# Altium schematic sheet sika_UI.SchDoc: Sika UI
size A3; Author: Alberto Gianelli; Organization: MIND Music Labs; Address1: Jarlaplan 2; Address2: 11357 Stockholm, Sweden; Licence: cc-by-sa; Email: tech@elk.audio
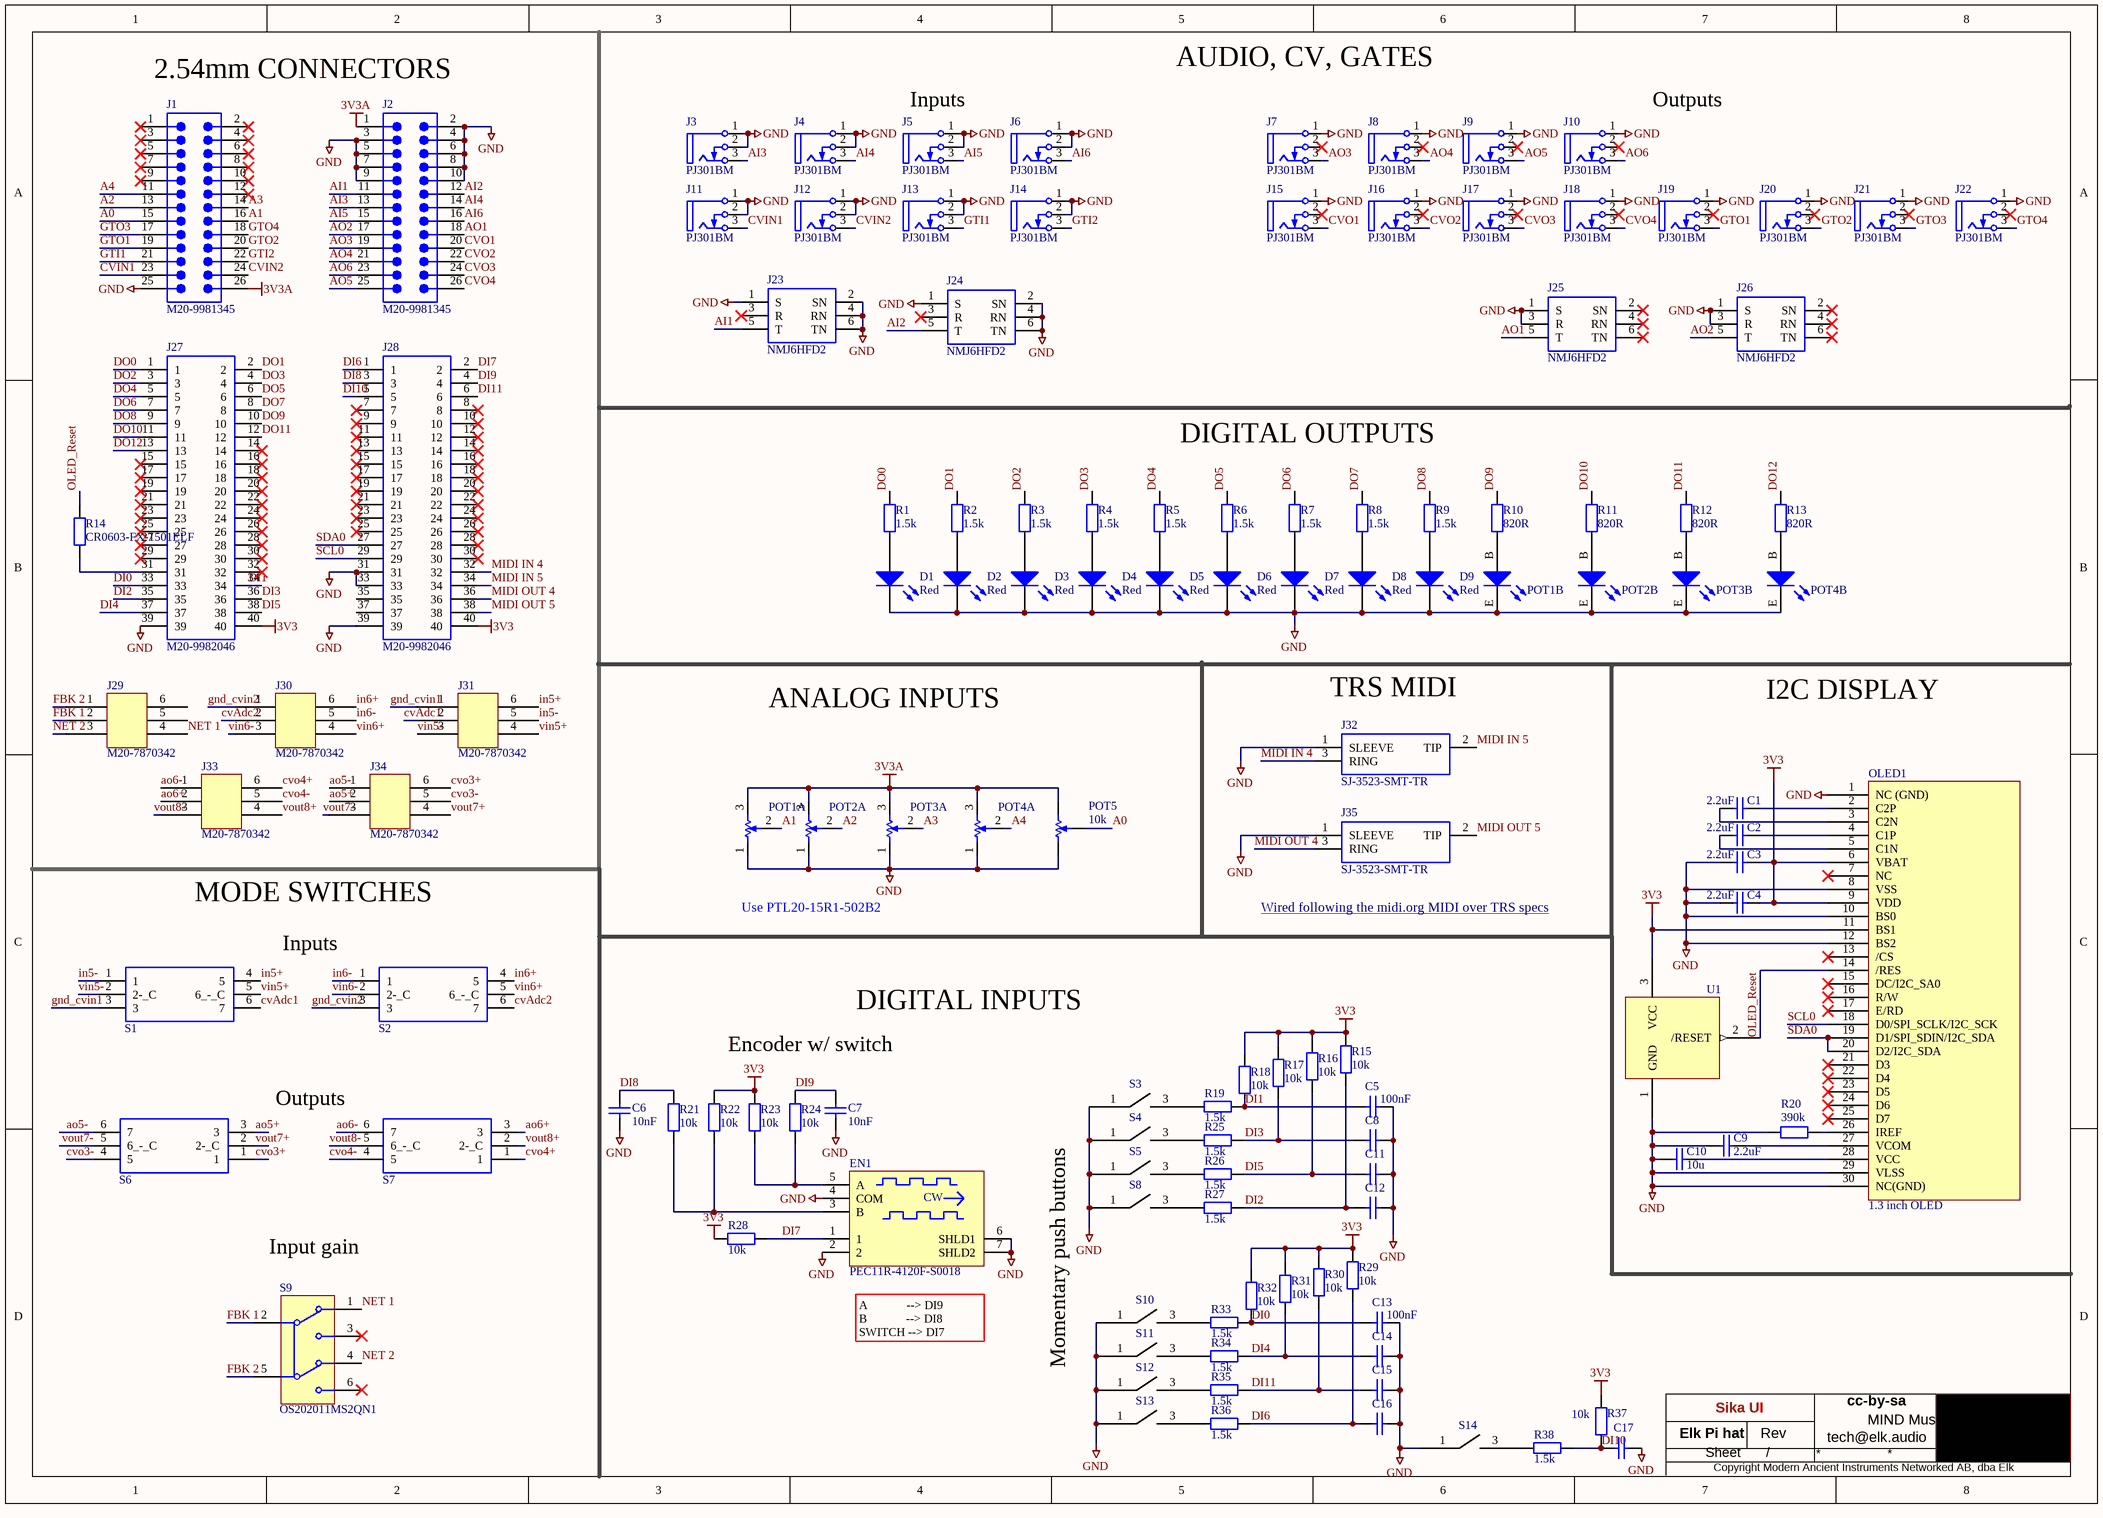
[diagram p0: sika_UI.SchDoc]

## Parts
C1  Capacitance: 2.2uF  [C0603]  (hidden comment: CL10B225KP8NNNC)
C2  Capacitance: 2.2uF  [C0603]  (hidden comment: CL10B225KP8NNNC)
C3  Capacitance: 2.2uF  [C0603]  (hidden comment: CL10B225KP8NNNC)
C4  Capacitance: 2.2uF  [C0603]  (hidden comment: CL10B225KP8NNNC)
C5  Capacitance: 100nF  [C0603]  (hidden comment: CL10B104KO8NNNC)
C6  Capacitance: 10nF  [C0603]  (hidden comment: CL10b103JB8NNNC)
C7  Capacitance: 10nF  [C0603]  (hidden comment: CL10b103JB8NNNC)
C8  CL10B104KO8NNNC  [C0603]  (value not drawn)
C9  Capacitance: 2.2uF  [C0603]  (hidden comment: CL10B225KP8NNNC)
C10  Capacitance: 10u  [C0603]  (hidden comment: CAP_10U)
C11  CL10B104KO8NNNC  [C0603]  (value not drawn)
C12  CL10B104KO8NNNC  [C0603]  (value not drawn)
C13  Capacitance: 100nF  [C0603]  (hidden comment: CL10B104KO8NNNC)
C14  CL10B104KO8NNNC  [C0603]  (value not drawn)
C15  CL10B104KO8NNNC  [C0603]  (value not drawn)
C16  CL10B104KO8NNNC  [C0603]  (value not drawn)
C17  CL10B104KO8NNNC  [C0603]  (value not drawn)
D1  Color: Red  [PCB-9pb35s7134wdnkutz46f-1]  (hidden comment: 0)
D2  Color: Red  [PCB-9pb35s7134wdnkutz46f-1]  (hidden comment: 0)
D3  Color: Red  [PCB-9pb35s7134wdnkutz46f-1]  (hidden comment: 0)
D4  Color: Red  [PCB-9pb35s7134wdnkutz46f-1]  (hidden comment: 0)
D5  Color: Red  [PCB-9pb35s7134wdnkutz46f-1]  (hidden comment: 0)
D6  Color: Red  [PCB-9pb35s7134wdnkutz46f-1]  (hidden comment: 0)
D7  Color: Red  [PCB-9pb35s7134wdnkutz46f-1]  (hidden comment: 0)
D8  Color: Red  [PCB-9pb35s7134wdnkutz46f-1]  (hidden comment: 0)
D9  Color: Red  [PCB-9pb35s7134wdnkutz46f-1]  (hidden comment: 0)
EN1  PEC11R-4120F-S0018  [BOUR-PEC11R-4XXXF-SXXXX_V - Cloned]
J1  M20-9981345  [HEADER_26]
J2  M20-9981345  [HEADER_26]
J3  PJ301BM  [PJ301BM]
J4  PJ301BM  [PJ301BM]
J5  PJ301BM  [PJ301BM]
J6  PJ301BM  [PJ301BM]
J7  PJ301BM  [PJ301BM]
J8  PJ301BM  [PJ301BM]
J9  PJ301BM  [PJ301BM]
J10  PJ301BM  [PJ301BM]
J11  PJ301BM  [PJ301BM]
J12  PJ301BM  [PJ301BM]
J13  PJ301BM  [PJ301BM]
J14  PJ301BM  [PJ301BM]
J15  PJ301BM  [PJ301BM]
J16  PJ301BM  [PJ301BM]
J17  PJ301BM  [PJ301BM]
J18  PJ301BM  [PJ301BM]
J19  PJ301BM  [PJ301BM]
J20  PJ301BM  [PJ301BM]
J21  PJ301BM  [PJ301BM]
J22  PJ301BM  [PJ301BM]
J23  NMJ6HFD2  [NMJ6HFD2]
J24  NMJ6HFD2  [NMJ6HFD2]
J25  NMJ6HFD2  [NMJ6HFD2]
J26  NMJ6HFD2  [NMJ6HFD2]
J27  M20-9982046  [header2x20]
J28  M20-9982046  [header2x20]
J29  M20-7870342  [M207870342]
J30  M20-7870342  [M207870342]
J31  M20-7870342  [M207870342]
J32  SJ-3523-SMT-TR  [SJ3523SMTTR]
J33  M20-7870342  [M207870342]
J34  M20-7870342  [M207870342]
J35  SJ-3523-SMT-TR  [SJ3523SMTTR]
OLED1  1.3 inch OLED  [1.3 inch OLED]
POT1  PTL20-15R1  [slide pot 20 mm]  (value not drawn)  (parts A,B of 2)
POT2  PTL20-15R1  [slide pot 20 mm]  (value not drawn)  (parts A,B of 2)
POT3  PTL20-15R1  [slide pot 20 mm]  (value not drawn)  (parts A,B of 2)
POT4  PTL20-15R1  [slide pot 20 mm]  (value not drawn)  (parts A,B of 2)
POT5  10k  [trim pot 25mm]
R1  Resistance: 1.5k  [R0603]  (hidden comment: CR0603-FX-1501ELF)
R2  Resistance: 1.5k  [R0603]  (hidden comment: CR0603-FX-1501ELF)
R3  Resistance: 1.5k  [R0603]  (hidden comment: CR0603-FX-1501ELF)
R4  Resistance: 1.5k  [R0603]  (hidden comment: CR0603-FX-1501ELF)
R5  Resistance: 1.5k  [R0603]  (hidden comment: CR0603-FX-1501ELF)
R6  Resistance: 1.5k  [R0603]  (hidden comment: CR0603-FX-1501ELF)
R7  Resistance: 1.5k  [R0603]  (hidden comment: CR0603-FX-1501ELF)
R8  Resistance: 1.5k  [R0603]  (hidden comment: CR0603-FX-1501ELF)
R9  Resistance: 1.5k  [R0603]  (hidden comment: CR0603-FX-1501ELF)
R10  Resistance: 820R  [R0603]  (hidden comment: CR0603-FX-1501ELF)
R11  Resistance: 820R  [R0603]  (hidden comment: CR0603-FX-1501ELF)
R12  Resistance: 820R  [R0603]  (hidden comment: CR0603-FX-1501ELF)
R13  Resistance: 820R  [R0603]  (hidden comment: CR0603-FX-1501ELF)
R14  CR0603-FX-1501ELF  [R0603]
R15  Resistance: 10k  [R0603]  (hidden comment: CR0603-FX-1002ELF)
R16  Resistance: 10k  [R0603]  (hidden comment: CR0603-FX-1002ELF)
R17  Resistance: 10k  [R0603]  (hidden comment: CR0603-FX-1002ELF)
R18  Resistance: 10k  [R0603]  (hidden comment: CR0603-FX-1002ELF)
R19  Resistance: 1.5k  [R0603]  (hidden comment: CR0603-FX-1501ELF)
R20  390k  [R0603]
R21  Resistance: 10k  [R0603]  (hidden comment: CR0603-FX-1002ELF)
R22  Resistance: 10k  [R0603]  (hidden comment: CR0603-FX-1002ELF)
R23  Resistance: 10k  [R0603]  (hidden comment: CR0603-FX-1002ELF)
R24  Resistance: 10k  [R0603]  (hidden comment: CR0603-FX-1002ELF)
R25  Resistance: 1.5k  [R0603]  (hidden comment: CR0603-FX-1501ELF)
R26  Resistance: 1.5k  [R0603]  (hidden comment: CR0603-FX-1501ELF)
R27  Resistance: 1.5k  [R0603]  (hidden comment: CR0603-FX-1501ELF)
R28  Resistance: 10k  [R0603]  (hidden comment: CR0603-FX-1002ELF)
R29  Resistance: 10k  [R0603]  (hidden comment: CR0603-FX-1002ELF)
R30  Resistance: 10k  [R0603]  (hidden comment: CR0603-FX-1002ELF)
R31  Resistance: 10k  [R0603]  (hidden comment: CR0603-FX-1002ELF)
R32  Resistance: 10k  [R0603]  (hidden comment: CR0603-FX-1002ELF)
R33  Resistance: 1.5k  [R0603]  (hidden comment: CR0603-FX-1501ELF)
R34  Resistance: 1.5k  [R0603]  (hidden comment: CR0603-FX-1501ELF)
R35  Resistance: 1.5k  [R0603]  (hidden comment: CR0603-FX-1501ELF)
R36  Resistance: 1.5k  [R0603]  (hidden comment: CR0603-FX-1501ELF)
R37  Resistance: 10k  [R0603]  (hidden comment: CR0603-FX-1002ELF)
R38  Resistance: 1.5k  [R0603]  (hidden comment: CR0603-FX-1501ELF)
S1  *JS202011JAQN  [JS202011JAQN]  (value not drawn)
S2  *JS202011JAQN  [JS202011JAQN]  (value not drawn)
S3  Red Tact  [tactile_switch]  (value not drawn)
S4  Red Tact  [tactile_switch]  (value not drawn)
S5  Red Tact  [tactile_switch]  (value not drawn)
S6  *JS202011JAQN  [JS202011JAQN]  (value not drawn)
S7  *JS202011JAQN  [JS202011JAQN]  (value not drawn)
S8  Red Tact  [tactile_switch]  (value not drawn)
S9  OS202011MS2QN1  [OS202011MS2QN1]
S10  Red Tact  [tactile_switch]  (value not drawn)
S11  Red Tact  [tactile_switch]  (value not drawn)
S12  Black Tact  [tactile_switch]  (value not drawn)
S13  Red Tact  [tactile_switch]  (value not drawn)
S14  1825910-7  [tactile_switch]  (value not drawn)
U1  reset uC  [SOT95P245X110-3N]  (value not drawn)

## Nets
3V3: C3.1 C4.1 J27.40 J28.40 OLED1.6(VBAT) OLED1.9(VDD) OLED1.11(BS1) R15.2 R16.2 R17.2 R18.2 R22.2 R23.1 R28.2 R29.2 R30.2 R31.2 R32.2 R37.2 U1.3(VCC)
3V3A: J1.26 J2.1 POT1.3 POT2.3 POT3.3 POT4.3 POT5.P$1
GND: C3.2 C4.2 C5.2 C6.1 C7.1 C8.2 C9.2 C10.2 C11.2 C12.2 C13.2 C14.2 C15.2 C16.2 C17.2 D1.2(K) D2.2(K) D3.2(K) D4.2(K) D5.2(K) D6.2(K) D7.2(K) D8.2(K) D9.2(K) EN1.2 EN1.4(COM) EN1.6(SHLD1) EN1.7(SHLD2) J1.25 J2.2 J2.3 J2.4 J2.5 J2.6 J2.7 J2.8 J2.9 J2.10 J3.1(S) J3.2(TN) J4.1(S) J4.2(TN) J5.1(S) J5.2(TN) J6.1(S) J6.2(TN) J7.1(S) J8.1(S) J9.1(S) J10.1(S) J11.1(S) J11.2(TN) J12.1(S) J12.2(TN) J13.1(S) J13.2(TN) J14.1(S) J14.2(TN) J15.1(S) J16.1(S) J17.1(S) J18.1(S) J19.1(S) J20.1(S) J21.1(S) J22.1(S) J23.1(S) J23.2(SN) J23.4(RN) J23.6(TN) J24.1(S) J24.2(SN) J24.4(RN) J24.6(TN) J25.1(S) J25.3(R) J26.1(S) J26.3(R) J27.39 J28.31 J28.33 J28.39 J32.1(SLEEVE) J35.1(SLEEVE) OLED1.1(NC_(GND)) OLED1.8(VSS) OLED1.10(BS0) OLED1.12(BS2) OLED1.29(VLSS) OLED1.30(NC(GND)) POT1.1 POT1.E POT2.1 POT2.E POT3.1 POT3.E POT4.1 POT4.E POT5.P$3 R20.1 S3.1 S4.1 S5.1 S8.1 S10.1 S11.1 S12.1 S13.1 S14.1 U1.1(GND)
A0: J1.15 POT5.P$2
A1: J1.16 POT1.2
A2: J1.13 POT2.2
A3: J1.14 POT3.2
A4: J1.11 POT4.2
AI1: J2.11 J23.5(T)
AI2: J2.12 J24.5(T)
AI3: J2.13 J3.3(T)
AI4: J2.14 J4.3(T)
AI5: J2.15 J5.3(T)
AI6: J2.16 J6.3(T)
AO1: J2.18 J25.5(T)
AO2: J2.17 J26.5(T)
AO3: J2.19 J7.3(T)
AO4: J2.21 J8.3(T)
AO5: J2.25 J9.3(T)
ao5+: J34.2 S6.3
ao5-: J34.1 S6.6(7)
AO6: J2.23 J10.3(T)
ao6+: J33.2 S7.3
ao6-: J33.1 S7.6(7)
cvAdc1: J31.2 S1.6(7)
cvAdc2: J30.2 S2.6(7)
CVIN1: J1.23 J11.3(T)
CVIN2: J1.24 J12.3(T)
CVO1: J2.20 J15.3(T)
CVO2: J2.22 J16.3(T)
CVO3: J2.24 J17.3(T)
cvo3+: J34.6 S6.1
cvo3-: J34.5 S6.4(5)
CVO4: J2.26 J18.3(T)
cvo4+: J33.6 S7.1
cvo4-: J33.5 S7.4(5)
DI0: C13.1 J27.33 R32.1 R33.1
DI1: C5.1 J27.34 R18.1 R19.1
DI2: C12.1 J27.35 R15.1 R27.1
DI3: C8.1 J27.36 R17.1 R25.1
DI4: C14.1 J27.37 R31.1 R34.1
DI5: C11.1 J27.38 R16.1 R26.1
DI6: C16.1 J28.1 R29.1 R36.1
DI7: EN1.1 J28.2 R28.1
DI8: C6.2 J28.3 R21.1
DI9: C7.2 J28.4 R24.2
DI10: C17.1 J28.5 R37.1 R38.1
DI11: C15.1 J28.6 R30.1 R35.1
DO0: J27.1 R1.2
DO1: J27.2 R2.2
DO2: J27.3 R3.2
DO3: J27.4 R4.2
DO4: J27.5 R5.2
DO5: J27.6 R6.2
DO6: J27.7 R7.2
DO7: J27.8 R8.2
DO8: J27.9 R9.2
DO9: J27.10 R10.2
DO10: J27.11 R11.2
DO11: J27.12 R12.2
DO12: J27.13 R13.2
FBK 1: J29.2 S9.2
FBK 2: J29.1 S9.5
gnd_cvin1: J31.1 S1.3
gnd_cvin2: J30.1 S2.3
GTI1: J1.21 J13.3(T)
GTI2: J1.22 J14.3(T)
GTO1: J1.19 J19.3(T)
GTO2: J1.20 J20.3(T)
GTO3: J1.17 J21.3(T)
GTO4: J1.18 J22.3(T)
in5+: J31.6 S1.4(5)
in5-: J31.5 S1.1
in6+: J30.6 S2.4(5)
in6-: J30.5 S2.1
MIDI IN 4: J28.32 J32.3(RING)
MIDI IN 5: J28.34 J32.2(TIP)
MIDI OUT 4: J28.36 J35.3(RING)
MIDI OUT 5: J28.38 J35.2(TIP)
NET 1: J29.4 S9.1
NET 2: J29.3 S9.4
OLED_Reset: OLED1.14(/RES) R14.2 U1.2(/RESET)
SCL0: J28.29 OLED1.18(D0/SPI_SCLK/I2C_SCK)
SDA0: J28.27 OLED1.19(D1/SPI_SDIN/I2C_SDA) OLED1.20(D2/I2C_SDA)
vin5+: J31.4 S1.5(6_-_C)
vin5-: J31.3 S1.2(2-_C)
vin6+: J30.4 S2.5(6_-_C)
vin6-: J30.3 S2.2(2-_C)
vout7+: J34.4 S6.2(2-_C)
vout7-: J34.3 S6.5(6_-_C)
vout8+: J33.4 S7.2(2-_C)
vout8-: J33.3 S7.5(6_-_C)
NetC1_1: C1.1 OLED1.2(C2P)
NetC1_2: C1.2 OLED1.3(C2N)
NetC2_1: C2.1 OLED1.4(C1P)
NetC2_2: C2.2 OLED1.5(C1N)
NetC9_1: C9.1 OLED1.27(VCOM)
NetC10_1: C10.1 OLED1.28(VCC)
NetD1_1: D1.1(A) R1.1
NetD2_1: D2.1(A) R2.1
NetD3_1: D3.1(A) R3.1
NetD4_1: D4.1(A) R4.1
NetD5_1: D5.1(A) R5.1
NetD6_1: D6.1(A) R6.1
NetD7_1: D7.1(A) R7.1
NetD8_1: D8.1(A) R8.1
NetD9_1: D9.1(A) R9.1
NetEN1_3: EN1.3(B) R21.2 R22.1
NetEN1_5: EN1.5(A) R23.2 R24.1
NetJ27_31: J27.31 R14.1
NetOLED1_26: OLED1.26(IREF) R20.2
NetPOT1_B: POT1.B R10.1
NetPOT2_B: POT2.B R11.1
NetPOT3_B: POT3.B R12.1
NetPOT4_B: POT4.B R13.1
NetR19_2: R19.2 S3.3
NetR25_2: R25.2 S4.3
NetR26_2: R26.2 S5.3
NetR27_2: R27.2 S8.3
NetR33_2: R33.2 S10.3
NetR34_2: R34.2 S11.3
NetR35_2: R35.2 S12.3
NetR36_2: R36.2 S13.3
NetR38_2: R38.2 S14.3

Not connected (* = marked no-connect by the designer): J1 1* 2* 3* 4* 5* 6* 7* 8* 9* 10* 12*; J7 2(TN)*; J8 2(TN)*; J9 2(TN)*; J10 2(TN)*; J15 2(TN)*; J16 2(TN)*; J17 2(TN)*; J18 2(TN)*; J19 2(TN)*; J20 2(TN)*; J21 2(TN)*; J22 2(TN)*; J23 3(R)*; J24 3(R)*; J25 2(SN)* 4(RN)* 6(TN)*; J26 2(SN)* 4(RN)* 6(TN)*; J27 14* 15* 16* 17* 18* 19* 20* 21* 22* 23* 24* 25* 26* 27* 28* 29* 30* 32*; J28 7* 8* 9* 10* 11* 12* 13* 14* 15* 16* 17* 18* 19* 20* 21* 22* 23* 24* 25* 26* 28* 30* 35 37; J29 5 6; OLED1 7(NC)* 13(/CS)* 15(DC/I2C_SA0)* 16(R/W)* 17(E/RD)* 21(D3)* 22(D4)* 23(D5)* 24(D6)* 25(D7)*; S3 2 4; S4 2 4; S5 2 4; S8 2 4; S9 3* 6*; S10 2 4; S11 2 4; S12 2 4; S13 2 4; S14 2 4

## Notes on the sheet
- 2.54mm CONNECTORS
- (near J5) Inputs
- AUDIO, CV, GATES
- (near J10) Outputs
- DIGITAL OUTPUTS
- ANALOG INPUTS
- (near J32) TRS MIDI
- I2C DISPLAY
- MODE SWITCHES
- Use PTL20-15R1-502B2
- (near J35) Wired following the midi.org MIDI over TRS specs <https://www.midi.org/articles-old/trs-specification-adopted-and-released>
- Inputs
- Encoder w/ switch
- DIGITAL INPUTS
- Outputs
- (near S9) Input gain
- (near EN1) A             --> DI9
  B             --> DI8
  SWITCH --> DI7
- Momentary push buttons
- Elk Pi hat
- Sheet
- Rev
- /
- Copyright Modern Ancient Instruments Networked AB, dba Elk
- (in symbol PEC11R-4120F-S0018) CW

## Library data of the parts
C1-C4 C9 = CAP_2U2: Cap Ceramic 10%; Manufacturer: Samsung; Dielectric: X7R; Voltage Rating: 10V; Mount: Surface Mount; Case/Package: 0603; Material: Ceramic; Tolerance: 10%; Length: 1.6mm; ComponentLink1URL: https://www.verical.com/server-webapp/html/getDatasheet?partID=357418&src-supplier=Verical; ComponentLink1Description: https://www.verical.com/server-webapp/html/getDatasheet?partID=357418&src-supplier=Verical; ComponentLink2URL: https://produktinfo.conrad.com/datenblaetter/450000-474999/458176-da-01-en-VS_KONDENSATOR_0603.pdf?src-supplier=Conrad; ComponentLink2Description: https://produktinfo.conrad.com/datenblaetter/450000-474999/458176-da-01-en-VS_KONDENSATOR_0603.pdf?src-supplier=Conrad; Supplier 1: Digi-Key; Supplier 2: Digi-Key; Supplier Part Number 1: 1276-1134-1-ND; Supplier Part Number 2: 1276-1134-6-ND
C5 C13 = CAP_100N: Cap Ceramic 10%; Manufacturer: Samsung; Manufacturer Part Number: CL10B105KO8NNNC; Dielectric: X7R; Voltage Rating: 16V; RoHS: Yes; Mount: Surface Mount; Case/Package: 0603; Case Code (Metric): 1608; Case Code (Imperial): 0603; Material: Ceramic; Min Operating Temperature: -55°C; Max Operating Temperature: 125°C; Tolerance: 10%; Packaging: Tape and Reel; Voltage: 16V; Voltage Rating (DC): 16V; Length: 1.6mm; Height: 0.8mm; Width: 0.031inch; Thickness: 0.035inch; Depth: 0.8mm; Radiation Hardening: No; Lead Free: Lead Free; ComponentLink1URL: https://www.verical.com/server-webapp/html/getDatasheet?partID=357418&src-supplier=Verical; ComponentLink1Description: https://www.verical.com/server-webapp/html/getDatasheet?partID=357418&src-supplier=Verical; ComponentLink2URL: https://produktinfo.conrad.com/datenblaetter/450000-474999/458176-da-01-en-VS_KONDENSATOR_0603.pdf?src-supplier=Conrad; ComponentLink2Description: https://produktinfo.conrad.com/datenblaetter/450000-474999/458176-da-01-en-VS_KONDENSATOR_0603.pdf?src-supplier=Conrad; Supplier 1: Digi-Key; Supplier 2: Digi-Key; Supplier Part Number 1: 1276-1005-1-ND; Supplier Part Number 2: 1276-1005-2-ND
C6 C7 = CAP_10N: Cap Ceramic 10%; Manufacturer: Samsung; Manufacturer Part Number: CL10B105KO8NNNC; Voltage Rating: 16V; Dielectric: x7r; RoHS: Yes; Mount: Surface Mount; Case/Package: 0603; Case Code (Metric): 1608; Case Code (Imperial): 0603; Material: Ceramic; Min Operating Temperature: -55°C; Max Operating Temperature: 125°C; Tolerance: 10%; Packaging: Tape and Reel; Voltage: 16V; Voltage Rating (DC): 16V; Length: 1.6mm; Height: 0.8mm; Width: 0.031inch; Thickness: 0.035inch; Depth: 0.8mm; Radiation Hardening: No; Lead Free: Lead Free; ComponentLink1URL: https://www.verical.com/server-webapp/html/getDatasheet?partID=357418&src-supplier=Verical; ComponentLink1Description: https://www.verical.com/server-webapp/html/getDatasheet?partID=357418&src-supplier=Verical; ComponentLink2URL: https://produktinfo.conrad.com/datenblaetter/450000-474999/458176-da-01-en-VS_KONDENSATOR_0603.pdf?src-supplier=Conrad; ComponentLink2Description: https://produktinfo.conrad.com/datenblaetter/450000-474999/458176-da-01-en-VS_KONDENSATOR_0603.pdf?src-supplier=Conrad; Supplier 1: Digi-Key; Supplier Part Number 1: 1276-1103-1-ND
C8 C11 C12 C14-C17 = CAP_100N: Cap Ceramic 10%; Manufacturer: Samsung; Manufacturer Part Number: CL10B105KO8NNNC; Dielectric: X7R; Voltage Rating: 16V; Capacitance: 100nF; RoHS: Yes; Mount: Surface Mount; Case/Package: 0603; Case Code (Metric): 1608; Case Code (Imperial): 0603; Material: Ceramic; Min Operating Temperature: -55°C; Max Operating Temperature: 125°C; Tolerance: 10%; Packaging: Tape and Reel; Voltage: 16V; Voltage Rating (DC): 16V; Length: 1.6mm; Height: 0.8mm; Width: 0.031inch; Thickness: 0.035inch; Depth: 0.8mm; Radiation Hardening: No; Lead Free: Lead Free; ComponentLink1URL: https://www.verical.com/server-webapp/html/getDatasheet?partID=357418&src-supplier=Verical; ComponentLink1Description: https://www.verical.com/server-webapp/html/getDatasheet?partID=357418&src-supplier=Verical; ComponentLink2URL: https://produktinfo.conrad.com/datenblaetter/450000-474999/458176-da-01-en-VS_KONDENSATOR_0603.pdf?src-supplier=Conrad; ComponentLink2Description: https://produktinfo.conrad.com/datenblaetter/450000-474999/458176-da-01-en-VS_KONDENSATOR_0603.pdf?src-supplier=Conrad; Supplier 1: Digi-Key; Supplier 2: Digi-Key; Supplier Part Number 1: 1276-1005-1-ND; Supplier Part Number 2: 1276-1005-2-ND
C10 = CAP_10U: Cap Ceramic 10%; Manufacturer: Samsung; Manufacturer Part Number: CL10B105KO8NNNC; Dielectric: X7R; Voltage Rating: 16V; Mount: Surface Mount; Case/Package: 0603; Material: Ceramic; Tolerance: 10%; Length: 1.6mm; ComponentLink1URL: https://www.verical.com/server-webapp/html/getDatasheet?partID=357418&src-supplier=Verical; ComponentLink1Description: https://www.verical.com/server-webapp/html/getDatasheet?partID=357418&src-supplier=Verical; ComponentLink2URL: https://produktinfo.conrad.com/datenblaetter/450000-474999/458176-da-01-en-VS_KONDENSATOR_0603.pdf?src-supplier=Conrad; ComponentLink2Description: https://produktinfo.conrad.com/datenblaetter/450000-474999/458176-da-01-en-VS_KONDENSATOR_0603.pdf?src-supplier=Conrad; Supplier 1: Digi-Key; Supplier 2: Digi-Key; Supplier Part Number 1: 1276-1005-1-ND; Supplier Part Number 2: 1276-1005-2-ND; RoHS: Yes; Case Code (Metric): 1608; Case Code (Imperial): 0603; Min Operating Temperature: -55°C; Max Operating Temperature: 125°C; Packaging: Tape and Reel; Voltage: 16V; Voltage Rating (DC): 16V; Height: 0.8mm; Width: 0.031inch; Thickness: 0.035inch; Depth: 0.8mm; Radiation Hardening: No; Lead Free: Lead Free
D1-D9 = CMP-3990f44d6d24e657-1: Standard LEDs; SMD 0610 Dome Lens LED; 1.6x0.8 mm; Red; (Cut Reel); Manufacturer Part Number: APTD1608LSURCK; Octopart URL: http://octopart.com/aptd1608lsurck-kingbright-81228242; OctopartID: 3990f44d6d24e657; Supplier 1: Digi-Key; Supplier Part Number 1: 754-2038-1-ND
EN1 = PEC11R-4120F-S0018: Encoders 20mm SHAFT w/SWITCH; Manufacturer: Bourns; Number of Channels: 2; Encoder Type: Mechanical; Pulses per Revolution: 18; Detent: Yes; Output Type: Quadrature; Hole Diameter: 1mm; Supplier 1: Digi-Key; Manufacturer Part Number: PEC11R-4120F-S0018; Stock 1: 443; Pricing 1: 1 = 1,91000, 10 = 1,68200, 25 = 1,50800, 75 = 1,45000, 150 = 1,39200, 300 = 1,33400, 525 = 1,10200, 1050 = 1,04400, 5025 = 0,87000 (USD); RoHS: Yes; Mount: Through Hole; Number of Pins: 5; Min Operating Temperature: -30°C; Max Operating Temperature: 70°C; Package Quantity: 75; Packaging: Bulk; Termination: PC Pin; Orientation: Vertical; Built in Switch: Yes; Length: 26.5mm; Height: 13.4mm; Width: 12.5mm; Radiation Hardening: No; REACH SVHC: No SVHC; ComponentLink1URL: https://datasheet.ciiva.com/29519/pec11r-29519849.pdf?src-supplier=Digi-Key; ComponentLink1Description: https://datasheet.ciiva.com/29519/pec11r-29519849.pdf?src-supplier=Digi-Key; ComponentLink2URL: https://datasheet.ciiva.com/12176/pec11r-221203-12176941.pdf?src-supplier=Mouser; ComponentLink2Description: https://datasheet.ciiva.com/12176/pec11r-221203-12176941.pdf?src-supplier=Mouser; ComponentLink3URL: https://datasheet.ciiva.com/29927/pec11r-29927631.pdf?src-supplier=Avnet; ComponentLink3Description: https://datasheet.ciiva.com/29927/pec11r-29927631.pdf?src-supplier=Avnet; Supplier 2: Mouser; Stock 2: 160; Pricing 2: 1 = 1,91000, 10 = 1,50000, 50 = 1,45000, 100 = 1,39000, 1000 = 1,04000, 10000 = 0,87000 (USD); Supplier Part Number 1: PEC11R-4120F-S0018-ND; Supplier Part Number 2: 652-PEC11R-4120F-S18
J1 J2 = HEADER_26: CONN HEADER 26POS .100 STR 15AU; Manufacturer: Amphenol FCI; Manufacturer Part Number: 67997-226HLF; Number of Contacts: 26; Current Rating: 3A; Voltage Rating: 1.5kV; Insulation Resistance: 5GR; Gender: Male; Connector Type: Male Pin; Pitch: 2.54mm; Row Spacing: 0.1inch; Contact Post Length: 3.05mm; Contact Resistance: 25mR; RoHS: Yes; Mount: Through Hole; Contact Plating: Gold; Contact Material: Bronze; Color: Black; Housing Color: Black; Housing Material: Thermoplastic; Min Operating Temperature: -65°C; Max Operating Temperature: 125°C; Number of Rows: 2; Termination: Solder; Package Quantity: 100; Packaging: Bulk; Contact Gender: Male; Number of Positions: 26; Max Voltage Rating (AC): 1.5kV; Orientation: Straight; Length: 33.02mm; Contact Mating Length: 0.23inch; Depth: 4.83mm; Flammability Rating: UL94 V-0; ComponentLink1URL: https://datasheet.ciiva.com/5151/67996-223434-5151673.pdf?src-supplier=Mouser; ComponentLink1Description: https://datasheet.ciiva.com/5151/67996-223434-5151673.pdf?src-supplier=Mouser; ComponentLink2URL: https://datasheet.ciiva.com/729/67996-729016.pdf?src-supplier=Digi-Key; ComponentLink2Description: https://datasheet.ciiva.com/729/67996-729016.pdf?src-supplier=Digi-Key; ComponentLink3URL: https://datasheet.ciiva.com/16726/67996-16726297.pdf?src-supplier=Avnet+Europe; ComponentLink3Description: https://datasheet.ciiva.com/16726/67996-16726297.pdf?src-supplier=Avnet+Europe; ComponentLink4URL: https://datasheet.ciiva.com/10125/67996-10125053.pdf?src-supplier=Avnet; ComponentLink4Description: https://datasheet.ciiva.com/10125/67996-10125053.pdf?src-supplier=Avnet; ComponentLink5URL: http://www.mouser.com/ds/2/181/Harwin_Product_Catalog_page_207-1131241.pdf?src-supplier=Mouser; ComponentLink5Description: http://www.mouser.com/ds/2/181/Harwin_Product_Catalog_page_207-1131241.pdf?src-supplier=Mouser; Max Current Rating: 3A; ComponentLink6URL: http://components.arrow.com/part/dataview/0323_00725754?src-supplier=Arrow+Europe; ComponentLink6Description: http://components.arrow.com/part/dataview/0323_00725754?src-supplier=Arrow+Europe; ComponentLink7URL: http://www.harwin.com/include/downloads/pdfs/2010PAGE129.PDF?src-supplier=Avnet; ComponentLink7Description: http://www.harwin.com/include/downloads/pdfs/2010PAGE129.PDF?src-supplier=Avnet; ComponentLink8URL: https://cdn.harwin.com/pdfs/60page147.pdf?src-supplier=Avnet+Europe; ComponentLink8Description: https://cdn.harwin.com/pdfs/60page147.pdf?src-supplier=Avnet+Europe; Supplier 1: Digi-Key; Stock 1: 2058; Pricing 1: 1 = 0,91000, 10 = 0,80100, 100 = 0,69080, 500 = 0,56520, 1000 = 0,50240, 5000 = 0,43960, 10000 = 0,41762 (USD); ComponentLink9URL: http://cdn.harwin.com/pdfs/60page147.pdf?src-supplier=Digi-Key; ComponentLink9Description: http://cdn.harwin.com/pdfs/60page147.pdf?src-supplier=Digi-Key; ComponentLink10URL: https://cdn.harwin.com/pdfs/Harwin_PC_Connectors_M20.pdf?src-supplier=Digi-Key; ComponentLink10Description: https://cdn.harwin.com/pdfs/Harwin_PC_Connectors_M20.pdf?src-supplier=Digi-Key; Supplier Part Number 1: 952-3297-ND
J23-J26 = NMJ6HFD2: Phone Connectors 3C STEREO 3-SPST NC; Manufacturer_Name: Neutrik; Allied_Number: 70229136; Geometry.Height: 15.69mm; Manufacturer_Part_Number: NMJ6HFD2; Mouser Part Number: 550-20301; Mouser Price/Stock: https://www.mouser.com/Search/Refine.aspx?Keyword=550-20301; RS Part Number: *; RS Price/Stock: *; Allied Price/Stock: https://www.alliedelec.com/neutrik-nmj6hfd2/70229136/; Datasheet Link: https://www.neutrik.com/media/8586/download/st-nmj6hfd2.pdf?v=1
J27 J28 = HEADER_2X20: Unshrouded, Pitch 2.54 mm, 6.1 mm Mating distance; Manufacturer_Name: 3M; Manufacturer_Part_Number: 4P01-2A02-DA; Manufacturer: Harwin; Allied_Number: 70114575; Geometry.Height: 11.2mm; Number of Contacts: 20; Contact Resistance: 25mR; Max Current Rating: 3A; Gender: Male; Number of Positions: 40; Connector Type: Male Pin; Pitch: 0.1inch; RS Part Number: 8277403; RS Price/Stock: http://uk.rs-online.com/web/p/products/8277403; Allied Price/Stock: https://www.alliedelec.com/3m-4p01-2a02-da/70114575/; Arrow Part Number: 4P01-2A02-DA; Arrow Price/Stock: https://www.arrow.com/en/products/4p01-2a02-da/3m; Datasheet Link: http://multimedia.3m.com/mws/media/729589O/3mtm-conn-for-pc104-embedded-sys-apps-compliantbuscomp-cd2392.pdf; Supplier 1: Digi-Key; Manufacturer Part Number: M20-9982046; Stock 1: 281; Pricing 1: 1 = 1,40000, 10 = 1,22900, 100 = 1,06040, 500 = 0,86760, 1000 = 0,77120, 5000 = 0,67480, 10000 = 0,64106 (USD); RoHS: Yes; Mount: Through Hole; Contact Plating: Tin; Contact Material: Brass; Color: Black; Housing Color: Black; Housing Material: Nylon; Min Operating Temperature: -40°C; Max Operating Temperature: 105°C; Number of Rows: 2; Termination: Solder; Packaging: Bulk; Package Quantity: 100; Orientation: Straight; Length: 50.8mm; Row Spacing: 0.1inch; Depth: 5.08mm; Radiation Hardening: No; ComponentLink1URL: http://www.mouser.com/ds/2/181/Harwin_Product_Catalog_page_207-1131241.pdf?src-supplier=Mouser; ComponentLink1Description: http://www.mouser.com/ds/2/181/Harwin_Product_Catalog_page_207-1131241.pdf?src-supplier=Mouser; ComponentLink2URL: http://cdn.harwin.com/pdfs/60page147.pdf?src-supplier=Digi-Key; ComponentLink2Description: http://cdn.harwin.com/pdfs/60page147.pdf?src-supplier=Digi-Key; ComponentLink3URL: https://cdn.harwin.com/pdfs/M20-998.pdf?src-supplier=Digi-Key; ComponentLink3Description: https://cdn.harwin.com/pdfs/M20-998.pdf?src-supplier=Digi-Key; ComponentLink4URL: http://components.arrow.com/part/dataview/0323_00724856?src-supplier=Arrow+Europe; ComponentLink4Description: http://components.arrow.com/part/dataview/0323_00724856?src-supplier=Arrow+Europe; ComponentLink5URL: https://cdn.harwin.com/pdfs/Harwin_PC_Connectors_M20.pdf?src-supplier=Digi-Key; ComponentLink5Description: https://cdn.harwin.com/pdfs/Harwin_PC_Connectors_M20.pdf?src-supplier=Digi-Key; Supplier Part Number 1: 952-3298-ND; Weight: 0.083952oz; Contact Mating Length: 0.24inch; ComponentLink6URL: https://cdn.harwin.com/pdfs/60page147.pdf?src-supplier=Avnet+Europe; ComponentLink6Description: https://cdn.harwin.com/pdfs/60page147.pdf?src-supplier=Avnet+Europe
J29-J31 J33 J34 = M20-7870342: Manufacturer: Harwin; Number of Positions: 6; Connector Type: Receptacle,Socket; Pitch: 0.1inch; Supplier 1: Mouser; Manufacturer Part Number: M20-7870342; Stock 1: 5980; Pricing 1: 1 = 0,78000, 10 = 0,62600, 100 = 0,54400, 500 = 0,49000, 1000 = 0,43500, 2500 = 0,39400, 5000 = 0,38100, 10000 = 0,36200, 25000 = 0,34800 (USD); RoHS: Yes; Mount: Surface Mount; Color: Black; Contact Plating: Gold; Number of Rows: 2; Package Quantity: 73; Packaging: Rail/Tube; Termination: Solder; Row Spacing: 0.1inch; ComponentLink1URL: https://datasheet.ciiva.com/15015/m20-787-15015039.pdf?src-supplier=Digi-Key; ComponentLink1Description: https://datasheet.ciiva.com/15015/m20-787-15015039.pdf?src-supplier=Digi-Key; Supplier Part Number 1: 855-M20-7870342
J32 J35 = SJ-3523-SMT-TR: CONN JACK STEREO 3.5MM SMD R/A; Manufacturer: CUI; Gender: Female; Shielding: Unshielded; Current Rating: 1A; Number of Conductors: 3; Number of Ports: 1; Supplier 1: Digi-Key; Manufacturer Part Number: SJ-3523-SMT-TR; Stock 1: 33904; Pricing 1: 1 = 1,02000, 10 = 0,90000, 25 = 0,84760, 50 = 0,81220, 100 = 0,77680, 250 = 0,70620, 500 = 0,63558 (USD); RoHS: Yes; Mount: Surface Mount; Contact Plating: Silver; Color: Black; Packaging: Cut Tape; Termination: Solder; Connector Type: Jack; Orientation: Horizontal; Lead Free: Lead Free; ComponentLink1URL: https://datasheet.ciiva.com/7356/sj-352x-smt-series-7356569.pdf?src-supplier=Digi-Key; ComponentLink1Description: https://datasheet.ciiva.com/7356/sj-352x-smt-series-7356569.pdf?src-supplier=Digi-Key; ComponentLink2URL: https://datasheet.ciiva.com/7356/sj-352x-smt-series-7356553.pdf?src-supplier=Digi-Key; ComponentLink2Description: https://datasheet.ciiva.com/7356/sj-352x-smt-series-7356553.pdf?src-supplier=Digi-Key; Supplier Part Number 1: CP-3523SJCT-ND
POT5 = trimmer_pot: 25 mm tall (thonk); resistance: 10k; ComponentLink1Description: https://www.thonk.co.uk/shop/alpha-9mm-pots/; ComponentLink1URL: https://www.thonk.co.uk/shop/alpha-9mm-pots/
R1-R13 R19 R25-R27 R33-R36 R38 = RES_1K5: Resistor, Ceramic; Power rating: *mW; Precision: *%; Temp coefficient: *ppm; Voltage rating: *V; CustomComponentID: rbfzudi508nk54panp5s; Supplier 1: Digi-Key; Supplier Part Number 1: CR0603-FX-1501ELFCT-ND
R14 = RES_DNP: Resistor, Ceramic; Resistance: DNP; Power rating: *mW; Precision: *%; Temp coefficient: *ppm; Voltage rating: *V; CustomComponentID: rbfzudi508nk54panp5s; Supplier 1: Digi-Key; Supplier Part Number 1: CR0603-FX-1501ELFCT-ND
R15-R18 R21-R24 R28-R32 R37 = RES_10K: Resistor, Ceramic; Power rating: *mW; Precision: *%; Temp coefficient: *ppm; Voltage rating: *V; CustomComponentID: rbfzudi508nk54panp5s; Supplier 1: Digi-Key; Supplier Part Number 1: CR0603-FX-1002ELFCT-ND
R20 = RES_390K: Resistor, Ceramic; Power rating: *mW; Precision: *%; Temp coefficient: *ppm; Voltage rating: *V; CustomComponentID: rbfzudi508nk54panp5s; Resistance: 390k
S1 S2 S6 S7 = JS202011JAQN: SWITCH SMD SLIDE DPDT 300MA 6V; Manufacturer: ITT C&K; Supplier 1: Digi-Key; Manufacturer Part Number: JS202011JAQN; Stock 1: 8914; Pricing 1: 1 = 0,51000, 10 = 0,48800, 25 = 0,47760, 50 = 0,42680, 100 = 0,40660, 250 = 0,39640, 500 = 0,33542 (USD); RoHS: No; ComponentLink1URL: https://www.ckswitches.com/media/1422/js.pdf?src-supplier=Digi-Key; ComponentLink1Description: https://www.ckswitches.com/media/1422/js.pdf?src-supplier=Digi-Key; Supplier Part Number 1: CKN10722CT-ND
S3-S5 S8 S10-S13 = tactile_switch_red: Switch Tactile OFF (ON) SPST Round Button PC Pins 0.05A 24VDC 100000Cycles 2.55N Thru-Hole Loose; Manufacturer: TE Connectivity; Manufacturer Part Number: 1825910-7; Actuator Material: PBT; Max Voltage Rating (DC): 24V; Contact Resistance: 100mR; Illumination Type: Non-Illuminated; Contact Current Rating: 50mA; Switch Travel: 0.25mm; Switch Function: Off-Mom; Actuator Type: Standard; Actuator Length: 0.055inch; Supplier 1: Digi-Key; Stock 1: 162111; Pricing 1: 1 = 0,11000, 10 = 0,10600, 25 = 0,10240, 50 = 0,09900, 100 = 0,09340, 250 = 0,08792, 500 = 0,08428, 1000 = 0,06412, 5000 = 0,05313 (USD); RoHS: Yes; Mount: Through Hole; Contact Material: Copper Alloy; Contact Plating: Silver; Mechanical Life: 100000Cycles; Min Operating Temperature: -35°C; Max Operating Temperature: 85°C; Operating Force: 2.55N; Throw Configuration: SPST; Termination: PC Pins; Packaging: Loose Piece; Package Quantity: 750; Type: Switch; Voltage Rating (DC): 24V; Electrical Life: 100000Cycles; Orientation: Straight; Max Current Rating: 50mA; Length: 5.99mm; Depth: 7.8mm; Radiation Hardening: No; REACH SVHC: Unknown; ELV: Compliant; Lead Free: Lead Free; ComponentLink1URL: https://datasheet.ciiva.com/30117/17-30117153.pdf?src-supplier=Onlinecomponents.com; ComponentLink1Description: https://datasheet.ciiva.com/30117/17-30117153.pdf?src-supplier=Onlinecomponents.com; ComponentLink2URL: https://datasheet.ciiva.com/16312/1825910-7-16312610.pdf?src-supplier=Future+Electronics; ComponentLink2Description: https://datasheet.ciiva.com/16312/1825910-7-16312610.pdf?src-supplier=Future+Electronics; ComponentLink3URL: https://datasheet.ciiva.com/16987/0900766b808a3755-16987820.pdf?src-supplier=Allied+Electronics; ComponentLink3Description: https://datasheet.ciiva.com/16987/0900766b808a3755-16987820.pdf?src-supplier=Allied+Electronics; Supplier Part Number 1: 450-1804-ND
S9 = OS202011MS2QN1: SWITCH SLIDE DPDT 100MA 12V; Manufacturer: ITT C&K; Mechanical Life: 10000Cycles; Actuator Material: Polyoxymethylene,Acetal; Switch Travel: 2mm; Switch Function: On-On; Actuator Type: Standard; Actuator Length: 4mm; Supplier 1: Digi-Key; Manufacturer Part Number: OS202011MS2QN1; Stock 1: 4212; Pricing 1: 1 = 0,60000, 10 = 0,57200, 25 = 0,56000, 50 = 0,50060, 100 = 0,47670, 250 = 0,46480, 500 = 0,39328, 1000 = 0,38136, 5000 = 0,33369 (USD); RoHS: Yes; Mount: Through Hole,Brackets; Contact Material: Copper Alloy; Contact Plating: Silver,Gold; Housing Material: Resin; Min Operating Temperature: -30°C; Max Operating Temperature: 70°C; Throw Configuration: DPDT; Max Voltage Rating (DC): 12V; Packaging: Bulk; Termination: PC Pins; Orientation: Straight; Voltage Rating (DC): 12V; Max Current Rating: 100mA; Package Quantity: 200; Current Rating: 100mA; Electrical Life: 10000Cycles; Length: 8.6mm; Depth: 6.8mm; Radiation Hardening: No; REACH SVHC: No SVHC; Lead Free: Lead Free; ComponentLink1URL: https://datasheet.ciiva.com/2889/os-19jan15-2889195.pdf?src-supplier=Digi-Key; ComponentLink1Description: https://datasheet.ciiva.com/2889/os-19jan15-2889195.pdf?src-supplier=Digi-Key; Supplier Part Number 1: CKN9545-ND
S14 = tactile_switch_red: Switch Tactile OFF (ON) SPST Round Button PC Pins 0.05A 24VDC 100000Cycles 2.55N Thru-Hole Loose; Manufacturer: TE Connectivity; Actuator Material: PBT; Max Voltage Rating (DC): 24V; Contact Resistance: 100mR; Illumination Type: Non-Illuminated; Contact Current Rating: 50mA; Switch Travel: 0.25mm; Switch Function: Off-Mom; Actuator Type: Standard; Actuator Length: 0.055inch; Supplier 1: Digi-Key; Manufacturer Part Number: 1825910-7; Stock 1: 162111; Pricing 1: 1 = 0,11000, 10 = 0,10600, 25 = 0,10240, 50 = 0,09900, 100 = 0,09340, 250 = 0,08792, 500 = 0,08428, 1000 = 0,06412, 5000 = 0,05313 (USD); RoHS: Yes; Mount: Through Hole; Contact Material: Copper Alloy; Contact Plating: Silver; Mechanical Life: 100000Cycles; Min Operating Temperature: -35°C; Max Operating Temperature: 85°C; Operating Force: 2.55N; Throw Configuration: SPST; Termination: PC Pins; Packaging: Loose Piece; Package Quantity: 750; Type: Switch; Voltage Rating (DC): 24V; Electrical Life: 100000Cycles; Orientation: Straight; Max Current Rating: 50mA; Length: 5.99mm; Depth: 7.8mm; Radiation Hardening: No; REACH SVHC: Unknown; ELV: Compliant; Lead Free: Lead Free; ComponentLink1URL: https://datasheet.ciiva.com/30117/17-30117153.pdf?src-supplier=Onlinecomponents.com; ComponentLink1Description: https://datasheet.ciiva.com/30117/17-30117153.pdf?src-supplier=Onlinecomponents.com; ComponentLink2URL: https://datasheet.ciiva.com/16312/1825910-7-16312610.pdf?src-supplier=Future+Electronics; ComponentLink2Description: https://datasheet.ciiva.com/16312/1825910-7-16312610.pdf?src-supplier=Future+Electronics; ComponentLink3URL: https://datasheet.ciiva.com/16987/0900766b808a3755-16987820.pdf?src-supplier=Allied+Electronics; ComponentLink3Description: https://datasheet.ciiva.com/16987/0900766b808a3755-16987820.pdf?src-supplier=Allied+Electronics; Supplier Part Number 1: 450-1804-ND
U1 = APX803-xxSAG-7
OLED1 = 1.3 inch OLED: ComponentLink1Description: alibaba; ComponentLink1URL: https://www.alibaba.com/product-detail/OLED-1-3-Inch-SSD1306-128x64_62133722486.html?spm=a2700.7724838.2017115.44.38de6fdcIjcxnA&s=p; ComponentLink2Description: adafruit reference; ComponentLink2URL: https://learn.adafruit.com/monochrome-oled-breakouts/downloads
POT1-POT4 = PTL20-15R1: ComponentLink1Description: Datasheet; ComponentLink1URL: https://www.bourns.com/docs/Product-Datasheets/PTL.pdf; Supplier link: https://www.mouser.se/ProductDetail/652-PTL20-15G1-203B2